# Vivado block design system, xc7z100ffg900-2, Vivado 2022.2
# (continued, part 2 of 3)
current_bd_instance /rx_fir_decimator

# ---- hierarchy /axi_adrv9009_rx_os_jesd ----
current_bd_instance /axi_adrv9009_rx_os_jesd
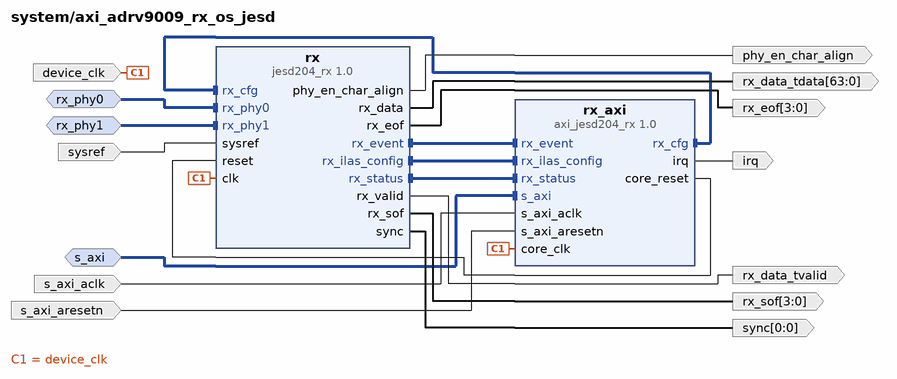
[diagram p13: block diagram inside /axi_adrv9009_rx_os_jesd]
create_bd_intf_pin -mode Slave -vlnv xilinx.com:interface:aximm_rtl:1.0 s_axi
create_bd_intf_pin -mode Slave -vlnv xilinx.com:display_jesd204:jesd204_rx_bus_rtl:1.0 rx_phy0
create_bd_intf_pin -mode Slave -vlnv xilinx.com:display_jesd204:jesd204_rx_bus_rtl:1.0 rx_phy1
create_bd_pin -dir I -type clk s_axi_aclk
create_bd_pin -dir I -type rst s_axi_aresetn
create_bd_pin -dir O -type intr irq
create_bd_pin -dir I -type clk device_clk
create_bd_pin -dir O -from 0 -to 0 sync
create_bd_pin -dir I sysref
create_bd_pin -dir O phy_en_char_align
create_bd_pin -dir O -from 3 -to 0 rx_eof
create_bd_pin -dir O -from 3 -to 0 rx_sof
create_bd_pin -dir O rx_data_tvalid
create_bd_pin -dir O -from 63 -to 0 rx_data_tdata

create_bd_cell -type ip -vlnv analog.com:user:jesd204_rx:1.0 rx
set_property -dict {CONFIG.NUM_LANES 2 CONFIG.NUM_LINKS 1} [get_bd_cells rx]
create_bd_cell -type ip -vlnv analog.com:user:axi_jesd204_rx:1.0 rx_axi
set_property -dict {CONFIG.NUM_LANES 2 CONFIG.NUM_LINKS 1} [get_bd_cells rx_axi]

# ---- hierarchy /rx_os_adrv9009_tpl_core ----
current_bd_instance /rx_os_adrv9009_tpl_core
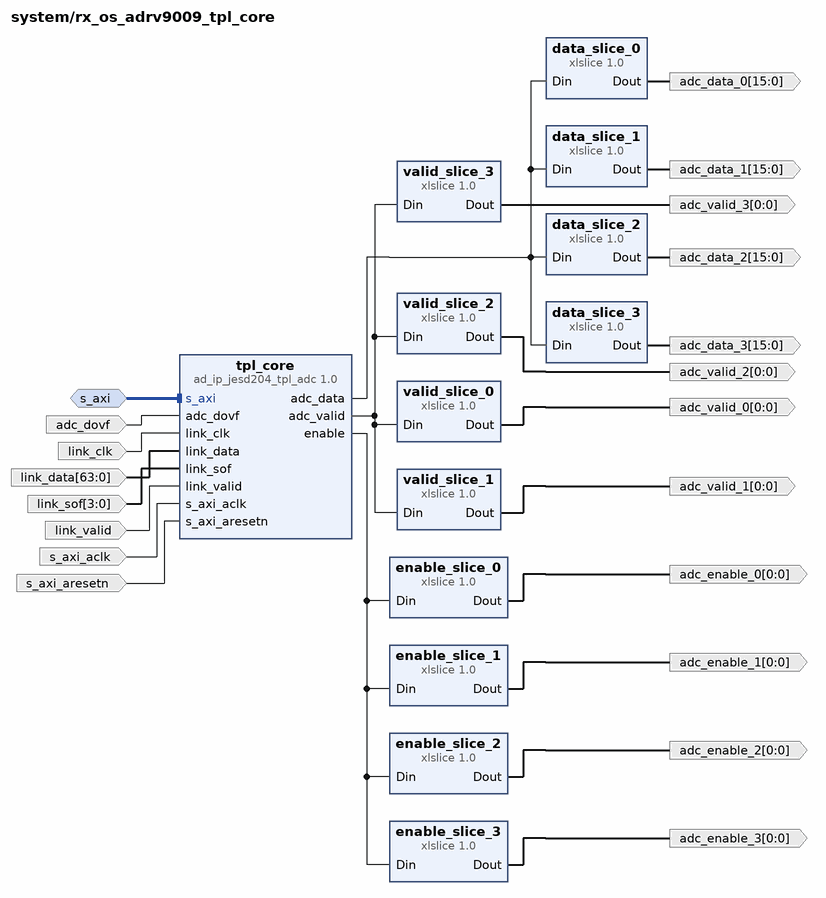
[diagram p14: block diagram inside /rx_os_adrv9009_tpl_core]
create_bd_intf_pin -mode Slave -vlnv xilinx.com:interface:aximm_rtl:1.0 s_axi
create_bd_pin -dir I -type clk s_axi_aclk
create_bd_pin -dir I -type rst s_axi_aresetn
create_bd_pin -dir I -type clk link_clk
create_bd_pin -dir I -from 3 -to 0 link_sof
create_bd_pin -dir I link_valid
create_bd_pin -dir I -from 63 -to 0 link_data
create_bd_pin -dir I adc_dovf
create_bd_pin -dir O -from 0 -to 0 adc_enable_0
create_bd_pin -dir O -from 0 -to 0 adc_valid_0
create_bd_pin -dir O -from 15 -to 0 adc_data_0
create_bd_pin -dir O -from 0 -to 0 adc_enable_1
create_bd_pin -dir O -from 0 -to 0 adc_valid_1
create_bd_pin -dir O -from 15 -to 0 adc_data_1
create_bd_pin -dir O -from 0 -to 0 adc_enable_2
create_bd_pin -dir O -from 0 -to 0 adc_valid_2
create_bd_pin -dir O -from 15 -to 0 adc_data_2
create_bd_pin -dir O -from 0 -to 0 adc_enable_3
create_bd_pin -dir O -from 0 -to 0 adc_valid_3
create_bd_pin -dir O -from 15 -to 0 adc_data_3

create_bd_cell -type ip -vlnv xilinx.com:ip:xlslice:1.0 data_slice_0
set_property -dict {CONFIG.DIN_FROM 15 CONFIG.DIN_TO 0 CONFIG.DIN_WIDTH 64 CONFIG.DOUT_WIDTH 16} [get_bd_cells data_slice_0]
create_bd_cell -type ip -vlnv xilinx.com:ip:xlslice:1.0 data_slice_1
set_property -dict {CONFIG.DIN_FROM 31 CONFIG.DIN_TO 16 CONFIG.DIN_WIDTH 64 CONFIG.DOUT_WIDTH 16} [get_bd_cells data_slice_1]
create_bd_cell -type ip -vlnv xilinx.com:ip:xlslice:1.0 data_slice_2
set_property -dict {CONFIG.DIN_FROM 47 CONFIG.DIN_TO 32 CONFIG.DIN_WIDTH 64} [get_bd_cells data_slice_2]
create_bd_cell -type ip -vlnv xilinx.com:ip:xlslice:1.0 data_slice_3
set_property -dict {CONFIG.DIN_FROM 63 CONFIG.DIN_TO 48 CONFIG.DIN_WIDTH 64} [get_bd_cells data_slice_3]
create_bd_cell -type ip -vlnv xilinx.com:ip:xlslice:1.0 enable_slice_0
set_property -dict {CONFIG.DIN_FROM 0 CONFIG.DIN_TO 0 CONFIG.DIN_WIDTH 4} [get_bd_cells enable_slice_0]
create_bd_cell -type ip -vlnv xilinx.com:ip:xlslice:1.0 enable_slice_1
set_property -dict {CONFIG.DIN_FROM 1 CONFIG.DIN_TO 1 CONFIG.DIN_WIDTH 4} [get_bd_cells enable_slice_1]
create_bd_cell -type ip -vlnv xilinx.com:ip:xlslice:1.0 enable_slice_2
set_property -dict {CONFIG.DIN_FROM 2 CONFIG.DIN_TO 2 CONFIG.DIN_WIDTH 4} [get_bd_cells enable_slice_2]
create_bd_cell -type ip -vlnv xilinx.com:ip:xlslice:1.0 enable_slice_3
set_property -dict {CONFIG.DIN_FROM 3 CONFIG.DIN_TO 3 CONFIG.DIN_WIDTH 4} [get_bd_cells enable_slice_3]
create_bd_cell -type ip -vlnv xilinx.com:ip:xlslice:1.0 valid_slice_0
set_property -dict {CONFIG.DIN_FROM 0 CONFIG.DIN_TO 0 CONFIG.DIN_WIDTH 4} [get_bd_cells valid_slice_0]
create_bd_cell -type ip -vlnv xilinx.com:ip:xlslice:1.0 valid_slice_1
set_property -dict {CONFIG.DIN_FROM 1 CONFIG.DIN_TO 1 CONFIG.DIN_WIDTH 4} [get_bd_cells valid_slice_1]
create_bd_cell -type ip -vlnv xilinx.com:ip:xlslice:1.0 valid_slice_2
set_property -dict {CONFIG.DIN_FROM 2 CONFIG.DIN_TO 2 CONFIG.DIN_WIDTH 4} [get_bd_cells valid_slice_2]
create_bd_cell -type ip -vlnv xilinx.com:ip:xlslice:1.0 valid_slice_3
set_property -dict {CONFIG.DIN_FROM 3 CONFIG.DIN_TO 3 CONFIG.DIN_WIDTH 4} [get_bd_cells valid_slice_3]
create_bd_cell -type ip -vlnv analog.com:user:ad_ip_jesd204_tpl_adc:1.0 tpl_core
set_property -dict [list \
  CONFIG.BITS_PER_SAMPLE 16 \
  CONFIG.CONVERTER_RESOLUTION 16 \
  CONFIG.NUM_CHANNELS 4 \
  CONFIG.NUM_LANES 2 \
  CONFIG.OCTETS_PER_BEAT 4 \
  CONFIG.SAMPLES_PER_FRAME 1 \
] [get_bd_cells tpl_core]

# ---- connections ----

current_bd_instance /axi_adrv9009_tx_jesd
connect_bd_intf_net [get_bd_intf_pins s_axi] [get_bd_intf_pins tx_axi/s_axi]
connect_bd_intf_net [get_bd_intf_pins tx_axi/tx_cfg] [get_bd_intf_pins tx/tx_cfg]
connect_bd_intf_net [get_bd_intf_pins tx_axi/tx_ctrl] [get_bd_intf_pins tx/tx_ctrl]
connect_bd_intf_net [get_bd_intf_pins tx_data] [get_bd_intf_pins tx/tx_data]
connect_bd_intf_net [get_bd_intf_pins tx/tx_event] [get_bd_intf_pins tx_axi/tx_event]
connect_bd_intf_net [get_bd_intf_pins tx/tx_ilas_config] [get_bd_intf_pins tx_axi/tx_ilas_config]
connect_bd_intf_net [get_bd_intf_pins tx_phy0] [get_bd_intf_pins tx/tx_phy0]
connect_bd_intf_net [get_bd_intf_pins tx_phy1] [get_bd_intf_pins tx/tx_phy1]
connect_bd_intf_net [get_bd_intf_pins tx_phy2] [get_bd_intf_pins tx/tx_phy2]
connect_bd_intf_net [get_bd_intf_pins tx_phy3] [get_bd_intf_pins tx/tx_phy3]
connect_bd_intf_net [get_bd_intf_pins tx/tx_status] [get_bd_intf_pins tx_axi/tx_status]
connect_bd_net [get_bd_pins device_clk] [get_bd_pins tx/clk] [get_bd_pins tx_axi/core_clk]
connect_bd_net [get_bd_pins s_axi_aclk] [get_bd_pins tx_axi/s_axi_aclk]
connect_bd_net [get_bd_pins s_axi_aresetn] [get_bd_pins tx_axi/s_axi_aresetn]
connect_bd_net [get_bd_pins sync] [get_bd_pins tx/sync]
connect_bd_net [get_bd_pins sysref] [get_bd_pins tx/sysref]
connect_bd_net [get_bd_pins tx_axi/core_reset] [get_bd_pins tx/reset]
connect_bd_net [get_bd_pins tx_axi/irq] [get_bd_pins irq]

current_bd_instance /tx_fir_interpolator
connect_bd_net [get_bd_pins aclk] \
  [get_bd_pins rate_gen/clk] [get_bd_pins fir_interpolation_0/aclk] [get_bd_pins fir_interpolation_1/aclk] \
  [get_bd_pins fir_interpolation_2/aclk] [get_bd_pins fir_interpolation_3/aclk]
connect_bd_net [get_bd_pins active] \
  [get_bd_pins out_mux_1/select_path] [get_bd_pins out_mux_2/select_path] [get_bd_pins out_mux_3/select_path] \
  [get_bd_pins rate_gen/rstn] [get_bd_pins out_mux_0/select_path]
connect_bd_net -net dac_enable_0_1 [get_bd_pins dac_enable_0] [get_bd_pins out_mux_0/enable_in_0] [get_bd_pins out_mux_0/enable_in_1]
connect_bd_net -net dac_enable_1_1 [get_bd_pins dac_enable_1] [get_bd_pins out_mux_1/enable_in_1] [get_bd_pins out_mux_1/enable_in_0]
connect_bd_net -net dac_enable_2_1 [get_bd_pins dac_enable_2] [get_bd_pins out_mux_2/enable_in_1] [get_bd_pins out_mux_2/enable_in_0]
connect_bd_net -net dac_enable_3_1 [get_bd_pins dac_enable_3] [get_bd_pins out_mux_3/enable_in_1] [get_bd_pins out_mux_3/enable_in_0]
connect_bd_net -net dac_valid_0_1 [get_bd_pins dac_valid_0] [get_bd_pins out_mux_0/valid_in_0] [get_bd_pins logic_and_0/Op2]
connect_bd_net -net dac_valid_1_1 [get_bd_pins dac_valid_1] [get_bd_pins out_mux_1/valid_in_0] [get_bd_pins logic_and_1/Op2]
connect_bd_net -net dac_valid_2_1 [get_bd_pins dac_valid_2] [get_bd_pins out_mux_2/valid_in_0] [get_bd_pins logic_and_2/Op2]
connect_bd_net -net dac_valid_3_1 [get_bd_pins dac_valid_3] [get_bd_pins out_mux_3/valid_in_0] [get_bd_pins logic_and_3/Op2]
connect_bd_net -net data_in_0_1 [get_bd_pins data_in_0] [get_bd_pins out_mux_0/data_in_0] [get_bd_pins fir_interpolation_0/s_axis_data_tdata]
connect_bd_net -net data_in_1_1 [get_bd_pins data_in_1] [get_bd_pins out_mux_1/data_in_0] [get_bd_pins fir_interpolation_1/s_axis_data_tdata]
connect_bd_net -net data_in_2_1 [get_bd_pins data_in_2] [get_bd_pins out_mux_2/data_in_0] [get_bd_pins fir_interpolation_2/s_axis_data_tdata]
connect_bd_net -net data_in_3_1 [get_bd_pins data_in_3] [get_bd_pins out_mux_3/data_in_0] [get_bd_pins fir_interpolation_3/s_axis_data_tdata]
connect_bd_net [get_bd_pins fir_interpolation_0/m_axis_data_tdata] [get_bd_pins out_mux_0/data_in_1]
connect_bd_net [get_bd_pins fir_interpolation_1/m_axis_data_tdata] [get_bd_pins out_mux_1/data_in_1]
connect_bd_net [get_bd_pins fir_interpolation_2/m_axis_data_tdata] [get_bd_pins out_mux_2/data_in_1]
connect_bd_net [get_bd_pins fir_interpolation_3/m_axis_data_tdata] [get_bd_pins out_mux_3/data_in_1]
connect_bd_net [get_bd_pins load_config] [get_bd_pins rate_gen/load_config]
connect_bd_net [get_bd_pins logic_and_0/Res] [get_bd_pins fir_interpolation_0/s_axis_data_tvalid]
connect_bd_net [get_bd_pins logic_and_1/Res] [get_bd_pins fir_interpolation_1/s_axis_data_tvalid]
connect_bd_net [get_bd_pins logic_and_2/Res] [get_bd_pins fir_interpolation_2/s_axis_data_tvalid]
connect_bd_net [get_bd_pins logic_and_3/Res] [get_bd_pins fir_interpolation_3/s_axis_data_tvalid]
connect_bd_net [get_bd_pins out_mux_0/data_out] [get_bd_pins data_out_0]
connect_bd_net [get_bd_pins out_mux_0/enable_out] [get_bd_pins enable_out_0]
connect_bd_net [get_bd_pins out_mux_0/valid_out] [get_bd_pins valid_out_0]
connect_bd_net [get_bd_pins out_mux_1/data_out] [get_bd_pins data_out_1]
connect_bd_net [get_bd_pins out_mux_1/enable_out] [get_bd_pins enable_out_1]
connect_bd_net [get_bd_pins out_mux_1/valid_out] [get_bd_pins valid_out_1]
connect_bd_net [get_bd_pins out_mux_2/data_out] [get_bd_pins data_out_2]
connect_bd_net [get_bd_pins out_mux_2/enable_out] [get_bd_pins enable_out_2]
connect_bd_net [get_bd_pins out_mux_2/valid_out] [get_bd_pins valid_out_2]
connect_bd_net [get_bd_pins out_mux_3/data_out] [get_bd_pins data_out_3]
connect_bd_net [get_bd_pins out_mux_3/enable_out] [get_bd_pins enable_out_3]
connect_bd_net [get_bd_pins out_mux_3/valid_out] [get_bd_pins valid_out_3]
connect_bd_net [get_bd_pins pulse_width] [get_bd_pins rate_gen/pulse_width] [get_bd_pins rate_gen/pulse_period]
connect_bd_net [get_bd_pins rate_gen/pulse] \
  [get_bd_pins out_mux_1/valid_in_1] [get_bd_pins out_mux_2/valid_in_1] [get_bd_pins out_mux_3/valid_in_1] \
  [get_bd_pins out_mux_0/valid_in_1] [get_bd_pins logic_and_0/Op1] [get_bd_pins logic_and_1/Op1] \
  [get_bd_pins logic_and_2/Op1] [get_bd_pins logic_and_3/Op1]

current_bd_instance /tx_adrv9009_tpl_core
connect_bd_intf_net [get_bd_intf_pins s_axi] [get_bd_intf_pins tpl_core/s_axi]
connect_bd_intf_net [get_bd_intf_pins link] [get_bd_intf_pins tpl_core/link]
connect_bd_net -net dac_data_0_1 [get_bd_pins dac_data_0] [get_bd_pins data_concat/In0]
connect_bd_net -net dac_data_1_1 [get_bd_pins dac_data_1] [get_bd_pins data_concat/In1]
connect_bd_net -net dac_data_2_1 [get_bd_pins dac_data_2] [get_bd_pins data_concat/In2]
connect_bd_net -net dac_data_3_1 [get_bd_pins dac_data_3] [get_bd_pins data_concat/In3]
connect_bd_net [get_bd_pins dac_dunf] [get_bd_pins tpl_core/dac_dunf]
connect_bd_net [get_bd_pins data_concat/dout] [get_bd_pins tpl_core/dac_ddata]
connect_bd_net [get_bd_pins enable_slice_0/Dout] [get_bd_pins dac_enable_0]
connect_bd_net [get_bd_pins enable_slice_1/Dout] [get_bd_pins dac_enable_1]
connect_bd_net [get_bd_pins enable_slice_2/Dout] [get_bd_pins dac_enable_2]
connect_bd_net [get_bd_pins enable_slice_3/Dout] [get_bd_pins dac_enable_3]
connect_bd_net [get_bd_pins link_clk] [get_bd_pins tpl_core/link_clk]
connect_bd_net [get_bd_pins s_axi_aclk] [get_bd_pins tpl_core/s_axi_aclk]
connect_bd_net [get_bd_pins s_axi_aresetn] [get_bd_pins tpl_core/s_axi_aresetn]
connect_bd_net [get_bd_pins tpl_core/dac_valid] \
  [get_bd_pins valid_slice_0/Din] [get_bd_pins valid_slice_1/Din] [get_bd_pins valid_slice_2/Din] \
  [get_bd_pins valid_slice_3/Din]
connect_bd_net [get_bd_pins tpl_core/enable] \
  [get_bd_pins enable_slice_0/Din] [get_bd_pins enable_slice_1/Din] [get_bd_pins enable_slice_2/Din] \
  [get_bd_pins enable_slice_3/Din]
connect_bd_net [get_bd_pins valid_slice_0/Dout] [get_bd_pins dac_valid_0]
connect_bd_net [get_bd_pins valid_slice_1/Dout] [get_bd_pins dac_valid_1]
connect_bd_net [get_bd_pins valid_slice_2/Dout] [get_bd_pins dac_valid_2]
connect_bd_net [get_bd_pins valid_slice_3/Dout] [get_bd_pins dac_valid_3]

current_bd_instance /axi_adrv9009_rx_jesd
connect_bd_intf_net [get_bd_intf_pins rx_axi/rx_cfg] [get_bd_intf_pins rx/rx_cfg]
connect_bd_intf_net [get_bd_intf_pins rx_phy0] [get_bd_intf_pins rx/rx_phy0]
connect_bd_intf_net [get_bd_intf_pins rx_phy1] [get_bd_intf_pins rx/rx_phy1]
connect_bd_intf_net [get_bd_intf_pins rx/rx_event] [get_bd_intf_pins rx_axi/rx_event]
connect_bd_intf_net [get_bd_intf_pins rx/rx_ilas_config] [get_bd_intf_pins rx_axi/rx_ilas_config]
connect_bd_intf_net [get_bd_intf_pins rx/rx_status] [get_bd_intf_pins rx_axi/rx_status]
connect_bd_intf_net [get_bd_intf_pins s_axi] [get_bd_intf_pins rx_axi/s_axi]
connect_bd_net [get_bd_pins device_clk] [get_bd_pins rx/clk] [get_bd_pins rx_axi/core_clk]
connect_bd_net [get_bd_pins rx_axi/core_reset] [get_bd_pins rx/reset] [get_bd_pins iq_core_reset]
connect_bd_net [get_bd_pins rx_axi/irq] [get_bd_pins irq]
connect_bd_net [get_bd_pins rx/phy_en_char_align] [get_bd_pins phy_en_char_align]
connect_bd_net [get_bd_pins rx/rx_data] [get_bd_pins rx_data_tdata]
connect_bd_net [get_bd_pins rx/rx_eof] [get_bd_pins rx_eof]
connect_bd_net [get_bd_pins rx/rx_sof] [get_bd_pins rx_sof]
connect_bd_net [get_bd_pins rx/rx_valid] [get_bd_pins rx_data_tvalid]
connect_bd_net [get_bd_pins rx/status_ctrl_state] [get_bd_pins iq_ctrl_state] [get_bd_pins rx_axi/core_status_ctrl_state]
connect_bd_net [get_bd_pins rx/status_lane_cgs_state] [get_bd_pins iq_lane_cgs_state] [get_bd_pins rx_axi/core_status_lane_cgs_state]
connect_bd_net [get_bd_pins rx/sync] [get_bd_pins sync]
connect_bd_net [get_bd_pins s_axi_aclk] [get_bd_pins rx_axi/s_axi_aclk]
connect_bd_net [get_bd_pins s_axi_aresetn] [get_bd_pins rx_axi/s_axi_aresetn]
connect_bd_net [get_bd_pins sysref] [get_bd_pins rx/sysref]

current_bd_instance /rx_adrv9009_tpl_core
connect_bd_intf_net [get_bd_intf_pins s_axi] [get_bd_intf_pins tpl_core/s_axi]
connect_bd_net [get_bd_pins adc_dovf] [get_bd_pins tpl_core/adc_dovf]
connect_bd_net -net data_slice_0_Dout [get_bd_pins data_slice_0/Dout] [get_bd_pins adc_data_0]
connect_bd_net -net data_slice_1_Dout [get_bd_pins data_slice_1/Dout] [get_bd_pins adc_data_1]
connect_bd_net -net data_slice_2_Dout [get_bd_pins data_slice_2/Dout] [get_bd_pins adc_data_2]
connect_bd_net -net data_slice_3_Dout [get_bd_pins data_slice_3/Dout] [get_bd_pins adc_data_3]
connect_bd_net -net enable_slice_0_Dout [get_bd_pins enable_slice_0/Dout] [get_bd_pins adc_enable_0]
connect_bd_net -net enable_slice_1_Dout [get_bd_pins enable_slice_1/Dout] [get_bd_pins adc_enable_1]
connect_bd_net [get_bd_pins enable_slice_2/Dout] [get_bd_pins adc_enable_2]
connect_bd_net [get_bd_pins enable_slice_3/Dout] [get_bd_pins adc_enable_3]
connect_bd_net [get_bd_pins link_clk] [get_bd_pins tpl_core/link_clk]
connect_bd_net [get_bd_pins link_data] [get_bd_pins tpl_core/link_data]
connect_bd_net [get_bd_pins link_sof] [get_bd_pins tpl_core/link_sof]
connect_bd_net [get_bd_pins link_valid] [get_bd_pins tpl_core/link_valid]
connect_bd_net [get_bd_pins s_axi_aclk] [get_bd_pins tpl_core/s_axi_aclk]
connect_bd_net [get_bd_pins s_axi_aresetn] [get_bd_pins tpl_core/s_axi_aresetn]
connect_bd_net [get_bd_pins tpl_core/adc_data] \
  [get_bd_pins data_slice_0/Din] [get_bd_pins data_slice_1/Din] [get_bd_pins data_slice_2/Din] [get_bd_pins data_slice_3/Din]
connect_bd_net [get_bd_pins tpl_core/adc_valid] \
  [get_bd_pins valid_slice_0/Din] [get_bd_pins valid_slice_1/Din] [get_bd_pins valid_slice_2/Din] \
  [get_bd_pins valid_slice_3/Din]
connect_bd_net [get_bd_pins tpl_core/enable] \
  [get_bd_pins enable_slice_0/Din] [get_bd_pins enable_slice_1/Din] [get_bd_pins enable_slice_2/Din] \
  [get_bd_pins enable_slice_3/Din]
connect_bd_net -net valid_slice_0_Dout [get_bd_pins valid_slice_0/Dout] [get_bd_pins adc_valid_0]
connect_bd_net -net valid_slice_1_Dout [get_bd_pins valid_slice_1/Dout] [get_bd_pins adc_valid_1]
connect_bd_net [get_bd_pins valid_slice_2/Dout] [get_bd_pins adc_valid_2]
connect_bd_net [get_bd_pins valid_slice_3/Dout] [get_bd_pins adc_valid_3]
set_property HDL_ATTRIBUTE.DEBUG true [get_bd_nets data_slice_0_Dout]
set_property HDL_ATTRIBUTE.DEBUG true [get_bd_nets data_slice_1_Dout]
set_property HDL_ATTRIBUTE.DEBUG true [get_bd_nets data_slice_2_Dout]
set_property HDL_ATTRIBUTE.DEBUG true [get_bd_nets data_slice_3_Dout]
set_property HDL_ATTRIBUTE.DEBUG true [get_bd_nets enable_slice_0_Dout]
set_property HDL_ATTRIBUTE.DEBUG true [get_bd_nets enable_slice_1_Dout]
set_property HDL_ATTRIBUTE.DEBUG true [get_bd_nets valid_slice_0_Dout]
set_property HDL_ATTRIBUTE.DEBUG true [get_bd_nets valid_slice_1_Dout]

current_bd_instance /rx_fir_decimator
connect_bd_net [get_bd_pins aclk] \
  [get_bd_pins fir_decimation_0/aclk] [get_bd_pins fir_decimation_1/aclk] [get_bd_pins fir_decimation_2/aclk] \
  [get_bd_pins fir_decimation_3/aclk]
connect_bd_net [get_bd_pins active] \
  [get_bd_pins out_mux_0/select_path] [get_bd_pins out_mux_1/select_path] [get_bd_pins out_mux_2/select_path] \
  [get_bd_pins out_mux_3/select_path]
connect_bd_net -net data_in_0_1 [get_bd_pins data_in_0] [get_bd_pins out_mux_0/data_in_0] [get_bd_pins fir_decimation_0/s_axis_data_tdata]
connect_bd_net -net data_in_1_1 [get_bd_pins data_in_1] [get_bd_pins out_mux_1/data_in_0] [get_bd_pins fir_decimation_1/s_axis_data_tdata]
connect_bd_net -net data_in_2_1 [get_bd_pins data_in_2] [get_bd_pins out_mux_2/data_in_0] [get_bd_pins fir_decimation_2/s_axis_data_tdata]
connect_bd_net -net data_in_3_1 [get_bd_pins data_in_3] [get_bd_pins out_mux_3/data_in_0] [get_bd_pins fir_decimation_3/s_axis_data_tdata]
connect_bd_net -net enable_in_0_1 [get_bd_pins enable_in_0] [get_bd_pins out_mux_0/enable_in_0] [get_bd_pins out_mux_0/enable_in_1]
connect_bd_net -net enable_in_1_1 [get_bd_pins enable_in_1] [get_bd_pins out_mux_1/enable_in_0] [get_bd_pins out_mux_1/enable_in_1]
connect_bd_net -net enable_in_2_1 [get_bd_pins enable_in_2] [get_bd_pins out_mux_2/enable_in_0] [get_bd_pins out_mux_2/enable_in_1]
connect_bd_net -net enable_in_3_1 [get_bd_pins enable_in_3] [get_bd_pins out_mux_3/enable_in_0] [get_bd_pins out_mux_3/enable_in_1]
connect_bd_net [get_bd_pins fir_decimation_0/m_axis_data_tdata] [get_bd_pins out_mux_0/data_in_1]
connect_bd_net [get_bd_pins fir_decimation_0/m_axis_data_tvalid] [get_bd_pins out_mux_0/valid_in_1]
connect_bd_net [get_bd_pins fir_decimation_1/m_axis_data_tdata] [get_bd_pins out_mux_1/data_in_1]
connect_bd_net [get_bd_pins fir_decimation_1/m_axis_data_tvalid] [get_bd_pins out_mux_1/valid_in_1]
connect_bd_net [get_bd_pins fir_decimation_2/m_axis_data_tdata] [get_bd_pins out_mux_2/data_in_1]
connect_bd_net [get_bd_pins fir_decimation_2/m_axis_data_tvalid] [get_bd_pins out_mux_2/valid_in_1]
connect_bd_net [get_bd_pins fir_decimation_3/m_axis_data_tdata] [get_bd_pins out_mux_3/data_in_1]
connect_bd_net [get_bd_pins fir_decimation_3/m_axis_data_tvalid] [get_bd_pins out_mux_3/valid_in_1]
connect_bd_net [get_bd_pins out_mux_0/data_out] [get_bd_pins data_out_0]
connect_bd_net [get_bd_pins out_mux_0/enable_out] [get_bd_pins enable_out_0]
connect_bd_net [get_bd_pins out_mux_0/valid_out] [get_bd_pins valid_out_0]
connect_bd_net [get_bd_pins out_mux_1/data_out] [get_bd_pins data_out_1]
connect_bd_net [get_bd_pins out_mux_1/enable_out] [get_bd_pins enable_out_1]
connect_bd_net [get_bd_pins out_mux_1/valid_out] [get_bd_pins valid_out_1]
connect_bd_net [get_bd_pins out_mux_2/data_out] [get_bd_pins data_out_2]
connect_bd_net [get_bd_pins out_mux_2/enable_out] [get_bd_pins enable_out_2]
connect_bd_net [get_bd_pins out_mux_2/valid_out] [get_bd_pins valid_out_2]
connect_bd_net [get_bd_pins out_mux_3/data_out] [get_bd_pins data_out_3]
connect_bd_net [get_bd_pins out_mux_3/enable_out] [get_bd_pins enable_out_3]
connect_bd_net [get_bd_pins out_mux_3/valid_out] [get_bd_pins valid_out_3]
connect_bd_net -net valid_in_0_1 [get_bd_pins valid_in_0] [get_bd_pins out_mux_0/valid_in_0] [get_bd_pins fir_decimation_0/s_axis_data_tvalid]
connect_bd_net -net valid_in_1_1 [get_bd_pins valid_in_1] [get_bd_pins out_mux_1/valid_in_0] [get_bd_pins fir_decimation_1/s_axis_data_tvalid]
connect_bd_net -net valid_in_2_1 [get_bd_pins valid_in_2] [get_bd_pins out_mux_2/valid_in_0] [get_bd_pins fir_decimation_2/s_axis_data_tvalid]
connect_bd_net -net valid_in_3_1 [get_bd_pins valid_in_3] [get_bd_pins out_mux_3/valid_in_0] [get_bd_pins fir_decimation_3/s_axis_data_tvalid]
set_property HDL_ATTRIBUTE.DEBUG true [get_bd_nets data_in_0_1]
set_property HDL_ATTRIBUTE.DEBUG true [get_bd_nets data_in_1_1]
set_property HDL_ATTRIBUTE.DEBUG true [get_bd_nets data_in_2_1]
set_property HDL_ATTRIBUTE.DEBUG true [get_bd_nets data_in_3_1]
set_property HDL_ATTRIBUTE.DEBUG true [get_bd_nets enable_in_0_1]
set_property HDL_ATTRIBUTE.DEBUG true [get_bd_nets enable_in_1_1]
set_property HDL_ATTRIBUTE.DEBUG true [get_bd_nets valid_in_0_1]
set_property HDL_ATTRIBUTE.DEBUG true [get_bd_nets valid_in_1_1]

current_bd_instance /axi_adrv9009_rx_os_jesd
connect_bd_intf_net [get_bd_intf_pins rx_axi/rx_cfg] [get_bd_intf_pins rx/rx_cfg]
connect_bd_intf_net [get_bd_intf_pins rx_phy0] [get_bd_intf_pins rx/rx_phy0]
connect_bd_intf_net [get_bd_intf_pins rx_phy1] [get_bd_intf_pins rx/rx_phy1]
connect_bd_intf_net [get_bd_intf_pins rx/rx_event] [get_bd_intf_pins rx_axi/rx_event]
connect_bd_intf_net [get_bd_intf_pins rx/rx_ilas_config] [get_bd_intf_pins rx_axi/rx_ilas_config]
connect_bd_intf_net [get_bd_intf_pins rx/rx_status] [get_bd_intf_pins rx_axi/rx_status]
connect_bd_intf_net [get_bd_intf_pins s_axi] [get_bd_intf_pins rx_axi/s_axi]
connect_bd_net [get_bd_pins device_clk] [get_bd_pins rx/clk] [get_bd_pins rx_axi/core_clk]
connect_bd_net [get_bd_pins rx_axi/core_reset] [get_bd_pins rx/reset]
connect_bd_net [get_bd_pins rx_axi/irq] [get_bd_pins irq]
connect_bd_net [get_bd_pins rx/phy_en_char_align] [get_bd_pins phy_en_char_align]
connect_bd_net [get_bd_pins rx/rx_data] [get_bd_pins rx_data_tdata]
connect_bd_net [get_bd_pins rx/rx_eof] [get_bd_pins rx_eof]
connect_bd_net [get_bd_pins rx/rx_sof] [get_bd_pins rx_sof]
connect_bd_net [get_bd_pins rx/rx_valid] [get_bd_pins rx_data_tvalid]
connect_bd_net [get_bd_pins rx/sync] [get_bd_pins sync]
connect_bd_net [get_bd_pins s_axi_aclk] [get_bd_pins rx_axi/s_axi_aclk]
connect_bd_net [get_bd_pins s_axi_aresetn] [get_bd_pins rx_axi/s_axi_aresetn]
connect_bd_net [get_bd_pins sysref] [get_bd_pins rx/sysref]

current_bd_instance /rx_os_adrv9009_tpl_core
connect_bd_intf_net [get_bd_intf_pins s_axi] [get_bd_intf_pins tpl_core/s_axi]
connect_bd_net [get_bd_pins adc_dovf] [get_bd_pins tpl_core/adc_dovf]
connect_bd_net [get_bd_pins data_slice_0/Dout] [get_bd_pins adc_data_0]
connect_bd_net [get_bd_pins data_slice_1/Dout] [get_bd_pins adc_data_1]
connect_bd_net [get_bd_pins data_slice_2/Dout] [get_bd_pins adc_data_2]
connect_bd_net [get_bd_pins data_slice_3/Dout] [get_bd_pins adc_data_3]
connect_bd_net [get_bd_pins enable_slice_0/Dout] [get_bd_pins adc_enable_0]
connect_bd_net [get_bd_pins enable_slice_1/Dout] [get_bd_pins adc_enable_1]
connect_bd_net [get_bd_pins enable_slice_2/Dout] [get_bd_pins adc_enable_2]
connect_bd_net [get_bd_pins enable_slice_3/Dout] [get_bd_pins adc_enable_3]
connect_bd_net [get_bd_pins link_clk] [get_bd_pins tpl_core/link_clk]
connect_bd_net [get_bd_pins link_data] [get_bd_pins tpl_core/link_data]
connect_bd_net [get_bd_pins link_sof] [get_bd_pins tpl_core/link_sof]
connect_bd_net [get_bd_pins link_valid] [get_bd_pins tpl_core/link_valid]
connect_bd_net [get_bd_pins s_axi_aclk] [get_bd_pins tpl_core/s_axi_aclk]
connect_bd_net [get_bd_pins s_axi_aresetn] [get_bd_pins tpl_core/s_axi_aresetn]
connect_bd_net [get_bd_pins tpl_core/adc_data] \
  [get_bd_pins data_slice_0/Din] [get_bd_pins data_slice_1/Din] [get_bd_pins data_slice_2/Din] [get_bd_pins data_slice_3/Din]
connect_bd_net [get_bd_pins tpl_core/adc_valid] \
  [get_bd_pins valid_slice_0/Din] [get_bd_pins valid_slice_1/Din] [get_bd_pins valid_slice_2/Din] \
  [get_bd_pins valid_slice_3/Din]
connect_bd_net [get_bd_pins tpl_core/enable] \
  [get_bd_pins enable_slice_0/Din] [get_bd_pins enable_slice_1/Din] [get_bd_pins enable_slice_2/Din] \
  [get_bd_pins enable_slice_3/Din]
connect_bd_net [get_bd_pins valid_slice_0/Dout] [get_bd_pins adc_valid_0]
connect_bd_net [get_bd_pins valid_slice_1/Dout] [get_bd_pins adc_valid_1]
connect_bd_net [get_bd_pins valid_slice_2/Dout] [get_bd_pins adc_valid_2]
connect_bd_net [get_bd_pins valid_slice_3/Dout] [get_bd_pins adc_valid_3]

current_bd_instance /
connect_bd_intf_net [get_bd_intf_ports TX_CONFIG_BRAM] [get_bd_intf_pins tx_cfg_bram/BRAM_PORTB]
connect_bd_intf_net [get_bd_intf_ports FDMA_S] [get_bd_intf_pins uiFDMA_0/FDMA_S]
connect_bd_intf_net [get_bd_intf_pins axi_cpu_interconnect/S00_AXI] [get_bd_intf_pins sys_ps7/M_AXI_GP0]
connect_bd_intf_net [get_bd_intf_pins axi_hp2_interconnect/S00_AXI] [get_bd_intf_pins axi_adrv9009_rx_dma/m_dest_axi]
connect_bd_intf_net [get_bd_intf_pins axi_hp0_interconnect/S02_AXI] [get_bd_intf_pins axi_adrv9009_rx_os_xcvr/m_axi]
connect_bd_intf_net [get_bd_intf_pins axi_adrv9009_rx_os_xcvr/up_ch_0] [get_bd_intf_pins util_adrv9009_xcvr/up_rx_2]
connect_bd_intf_net [get_bd_intf_pins axi_adrv9009_rx_os_xcvr/up_ch_1] [get_bd_intf_pins util_adrv9009_xcvr/up_rx_3]
connect_bd_intf_net [get_bd_intf_pins axi_adrv9009_rx_os_xcvr/up_es_0] [get_bd_intf_pins util_adrv9009_xcvr/up_es_2]
connect_bd_intf_net [get_bd_intf_pins axi_adrv9009_rx_os_xcvr/up_es_1] [get_bd_intf_pins util_adrv9009_xcvr/up_es_3]
connect_bd_intf_net [get_bd_intf_pins axi_hp0_interconnect/S01_AXI] [get_bd_intf_pins axi_adrv9009_rx_xcvr/m_axi]
connect_bd_intf_net [get_bd_intf_pins axi_adrv9009_rx_xcvr/up_ch_0] [get_bd_intf_pins util_adrv9009_xcvr/up_rx_0]
connect_bd_intf_net [get_bd_intf_pins axi_adrv9009_rx_xcvr/up_ch_1] [get_bd_intf_pins util_adrv9009_xcvr/up_rx_1]
connect_bd_intf_net [get_bd_intf_pins axi_adrv9009_rx_xcvr/up_es_0] [get_bd_intf_pins util_adrv9009_xcvr/up_es_0]
connect_bd_intf_net [get_bd_intf_pins axi_adrv9009_rx_xcvr/up_es_1] [get_bd_intf_pins util_adrv9009_xcvr/up_es_1]
connect_bd_intf_net [get_bd_intf_pins axi_hp3_interconnect/S00_AXI] [get_bd_intf_pins axi_adrv9009_tx_dma/m_src_axi]
connect_bd_intf_net [get_bd_intf_pins util_adrv9009_xcvr/tx_0] [get_bd_intf_pins axi_adrv9009_tx_jesd/tx_phy0]
connect_bd_intf_net [get_bd_intf_pins util_adrv9009_xcvr/tx_3] [get_bd_intf_pins axi_adrv9009_tx_jesd/tx_phy1]
connect_bd_intf_net [get_bd_intf_pins util_adrv9009_xcvr/tx_2] [get_bd_intf_pins axi_adrv9009_tx_jesd/tx_phy2]
connect_bd_intf_net [get_bd_intf_pins util_adrv9009_xcvr/tx_1] [get_bd_intf_pins axi_adrv9009_tx_jesd/tx_phy3]
connect_bd_intf_net [get_bd_intf_pins axi_adrv9009_tx_xcvr/up_ch_0] [get_bd_intf_pins util_adrv9009_xcvr/up_tx_0]
connect_bd_intf_net [get_bd_intf_pins axi_adrv9009_tx_xcvr/up_ch_1] [get_bd_intf_pins util_adrv9009_xcvr/up_tx_1]
connect_bd_intf_net [get_bd_intf_pins axi_adrv9009_tx_xcvr/up_ch_2] [get_bd_intf_pins util_adrv9009_xcvr/up_tx_2]
connect_bd_intf_net [get_bd_intf_pins axi_adrv9009_tx_xcvr/up_ch_3] [get_bd_intf_pins util_adrv9009_xcvr/up_tx_3]
connect_bd_intf_net [get_bd_intf_pins axi_adrv9009_tx_xcvr/up_cm_0] [get_bd_intf_pins util_adrv9009_xcvr/up_cm_0]
connect_bd_intf_net [get_bd_intf_pins axi_bram_ctrl_0/BRAM_PORTA] [get_bd_intf_pins blk_mem_gen_0/BRAM_PORTA]
connect_bd_intf_net [get_bd_intf_pins axi_cpu_interconnect/M00_AXI] [get_bd_intf_pins axi_iic_main/S_AXI]
connect_bd_intf_net [get_bd_intf_pins axi_cpu_interconnect/M01_AXI] [get_bd_intf_pins axi_sysid_0/s_axi]
connect_bd_intf_net [get_bd_intf_pins axi_cpu_interconnect/M05_AXI] [get_bd_intf_pins axi_spdif_tx_core/s_axi]
connect_bd_intf_net [get_bd_intf_pins axi_cpu_interconnect/M06_AXI] [get_bd_intf_pins rx_adrv9009_tpl_core/s_axi]
connect_bd_intf_net [get_bd_intf_pins axi_cpu_interconnect/M07_AXI] [get_bd_intf_pins tx_adrv9009_tpl_core/s_axi]
connect_bd_intf_net [get_bd_intf_pins axi_cpu_interconnect/M08_AXI] [get_bd_intf_pins rx_os_adrv9009_tpl_core/s_axi]
connect_bd_intf_net [get_bd_intf_pins axi_cpu_interconnect/M09_AXI] [get_bd_intf_pins axi_adrv9009_tx_xcvr/s_axi]
connect_bd_intf_net [get_bd_intf_pins axi_cpu_interconnect/M10_AXI] [get_bd_intf_pins axi_adrv9009_tx_clkgen/s_axi]
connect_bd_intf_net [get_bd_intf_pins axi_cpu_interconnect/M11_AXI] [get_bd_intf_pins axi_adrv9009_tx_jesd/s_axi]
connect_bd_intf_net [get_bd_intf_pins axi_cpu_interconnect/M12_AXI] [get_bd_intf_pins axi_adrv9009_tx_dma/s_axi]
connect_bd_intf_net [get_bd_intf_pins axi_cpu_interconnect/M13_AXI] [get_bd_intf_pins axi_adrv9009_rx_xcvr/s_axi]
connect_bd_intf_net [get_bd_intf_pins axi_cpu_interconnect/M14_AXI] [get_bd_intf_pins axi_adrv9009_rx_clkgen/s_axi]
connect_bd_intf_net [get_bd_intf_pins axi_cpu_interconnect/M15_AXI] [get_bd_intf_pins axi_adrv9009_rx_jesd/s_axi]
connect_bd_intf_net [get_bd_intf_pins axi_cpu_interconnect/M16_AXI] [get_bd_intf_pins axi_adrv9009_rx_dma/s_axi]
connect_bd_intf_net [get_bd_intf_pins axi_cpu_interconnect/M17_AXI] [get_bd_intf_pins axi_adrv9009_rx_os_xcvr/s_axi]
connect_bd_intf_net [get_bd_intf_pins axi_cpu_interconnect/M18_AXI] [get_bd_intf_pins axi_adrv9009_rx_os_clkgen/s_axi]
connect_bd_intf_net [get_bd_intf_pins axi_cpu_interconnect/M19_AXI] [get_bd_intf_pins axi_adrv9009_rx_os_jesd/s_axi]
connect_bd_intf_net [get_bd_intf_pins axi_cpu_interconnect/M21_AXI] [get_bd_intf_pins tx_control_gpio/S_AXI]
connect_bd_intf_net [get_bd_intf_pins axi_cpu_interconnect/M22_AXI] [get_bd_intf_pins tx_gt_status_gpio/S_AXI]
connect_bd_intf_net [get_bd_intf_pins axi_cpu_interconnect/M23_AXI] [get_bd_intf_pins tx_cfg_bram_ctrl/S_AXI]
connect_bd_intf_net [get_bd_intf_pins axi_hp0_interconnect/M00_AXI] [get_bd_intf_pins sys_ps7/S_AXI_HP0]
connect_bd_intf_net [get_bd_intf_pins axi_hp2_interconnect/M00_AXI] [get_bd_intf_pins sys_ps7/S_AXI_HP2]
connect_bd_intf_net [get_bd_intf_pins axi_hp3_interconnect/M00_AXI] [get_bd_intf_pins sys_ps7/S_AXI_HP3]
connect_bd_intf_net [get_bd_intf_ports iic_main] [get_bd_intf_pins axi_iic_main/IIC]
connect_bd_intf_net [get_bd_intf_pins axi_interconnect_0/M00_AXI] [get_bd_intf_pins sys_ps7/S_AXI_HP1]
connect_bd_intf_net [get_bd_intf_pins sys_ps7/DMA0_REQ] [get_bd_intf_pins axi_spdif_tx_core/dma_req]
connect_bd_intf_net [get_bd_intf_pins smartconnect_0/M00_AXI] [get_bd_intf_pins axi_bram_ctrl_0/S_AXI]
connect_bd_intf_net [get_bd_intf_pins smartconnect_0/M01_AXI] [get_bd_intf_pins axi_gpio_0/S_AXI]
connect_bd_intf_net [get_bd_intf_ports ddr] [get_bd_intf_pins sys_ps7/DDR]
connect_bd_intf_net [get_bd_intf_pins sys_ps7/DMA0_ACK] [get_bd_intf_pins axi_spdif_tx_core/dma_ack]
connect_bd_intf_net [get_bd_intf_ports fixed_io] [get_bd_intf_pins sys_ps7/FIXED_IO]
connect_bd_intf_net [get_bd_intf_pins sys_ps7/M_AXI_GP1] [get_bd_intf_pins smartconnect_0/S00_AXI]
connect_bd_intf_net [get_bd_intf_pins tx_cfg_bram_ctrl/BRAM_PORTA] [get_bd_intf_pins tx_cfg_bram/BRAM_PORTA]
connect_bd_intf_net [get_bd_intf_pins axi_adrv9009_tx_jesd/tx_data] [get_bd_intf_pins tx_adrv9009_tpl_core/link]
connect_bd_intf_net [get_bd_intf_pins uiFDMA_0/M_AXI] [get_bd_intf_pins axi_interconnect_0/S00_AXI]
connect_bd_intf_net [get_bd_intf_pins util_adrv9009_rx_cpack/packed_fifo_wr] [get_bd_intf_pins axi_adrv9009_rx_dma/fifo_wr]
connect_bd_intf_net [get_bd_intf_pins util_adrv9009_xcvr/rx_0] [get_bd_intf_pins axi_adrv9009_rx_jesd/rx_phy0]
connect_bd_intf_net [get_bd_intf_pins util_adrv9009_xcvr/rx_1] [get_bd_intf_pins axi_adrv9009_rx_jesd/rx_phy1]
connect_bd_intf_net [get_bd_intf_pins util_adrv9009_xcvr/rx_2] [get_bd_intf_pins axi_adrv9009_rx_os_jesd/rx_phy0]
connect_bd_intf_net [get_bd_intf_pins util_adrv9009_xcvr/rx_3] [get_bd_intf_pins axi_adrv9009_rx_os_jesd/rx_phy1]
connect_bd_net [get_bd_pins GND_1/dout] \
  [get_bd_pins tx_fir_interpolator/load_config] [get_bd_pins sys_concat_intc/In0] [get_bd_pins sys_concat_intc/In1] \
  [get_bd_pins sys_concat_intc/In2] [get_bd_pins sys_concat_intc/In3] [get_bd_pins sys_concat_intc/In4] \
  [get_bd_pins sys_concat_intc/In5] [get_bd_pins sys_concat_intc/In6] [get_bd_pins sys_concat_intc/In7] \
  [get_bd_pins wave_spi_new_0/spi_cs] [get_bd_pins dacfifo_axi_rstgen/mb_debug_sys_rst] \
  [get_bd_pins tx_ctrl_reset/aux_reset_in] [get_bd_pins tx_ctrl_reset/mb_debug_sys_rst]
connect_bd_net [get_bd_pins GND_32/dout] [get_bd_pins tx_fir_interpolator/pulse_width] [get_bd_pins wave_spi_new_0/spi_mosi]
connect_bd_net [get_bd_pins proc_sys_reset_1/peripheral_aresetn] \
  [get_bd_pins bram_add_fir_newname_0/rst_n] [get_bd_pins fft_add_mult_ip_new_0/aresetn] \
  [get_bd_pins fft_add_mult_ip_new_0/ddr_init_complete] [get_bd_pins find_bfs_top_1/rst_n]
connect_bd_net [get_bd_pins VCC_1/dout] \
  [get_bd_pins util_adrv9009_tx_upack/s_axis_valid] [get_bd_pins dacfifo_axi_rstgen/dcm_locked] \
  [get_bd_pins dacfifo_axi_rstgen/aux_reset_in]
connect_bd_net -net WaveOut_Spi_Top_0_Np [get_bd_pins wave_spi_new_0/Np] [get_bd_ports sampling_num]
connect_bd_net -net active_1 [get_bd_ports dac_fir_filter_active] [get_bd_pins tx_fir_interpolator/active]
connect_bd_net -net active_2 [get_bd_ports adc_fir_filter_active] [get_bd_pins rx_fir_decimator/active]
connect_bd_net -net adc_dovf_1 [get_bd_pins util_adrv9009_rx_cpack/fifo_wr_overflow] [get_bd_pins rx_adrv9009_tpl_core/adc_dovf]
connect_bd_net -net adc_dovf_2 [get_bd_pins util_adrv9009_rx_os_cpack/fifo_wr_overflow] [get_bd_pins rx_os_adrv9009_tpl_core/adc_dovf]
connect_bd_net -net adrv9009_rx_device_clk [get_bd_pins axi_adrv9009_rx_clkgen/clk_0] \
  [get_bd_pins axi_adrv9009_rx_jesd/device_clk] [get_bd_pins rx_adrv9009_tpl_core/link_clk] \
  [get_bd_pins rx_fir_decimator/aclk] [get_bd_pins adrv9009_rx_device_clk_rstgen/slowest_sync_clk] \
  [get_bd_pins util_adrv9009_rx_cpack/clk] [get_bd_pins util_adrv9009_xcvr/rx_clk_0] \
  [get_bd_pins util_adrv9009_xcvr/rx_clk_1] [get_bd_pins axi_adrv9009_rx_dma/fifo_wr_clk] [get_bd_ports clk_160] \
  [get_bd_pins uiFDMA_0/M_AXI_ACLK] [get_bd_pins sys_ps7/S_AXI_HP1_ACLK] [get_bd_ports clk_fs_half] \
  [get_bd_pins proc_sys_reset_1/slowest_sync_clk] [get_bd_pins state_change_0/clk] [get_bd_pins bram_rd_wr_1/clk] \
  [get_bd_pins axi_interconnect_0/ACLK] [get_bd_pins axi_interconnect_0/S00_ACLK] [get_bd_pins axi_interconnect_0/M00_ACLK] \
  [get_bd_pins blk_mem_gen_0/clkb] [get_bd_pins bram_add_fir_newname_0/clk] [get_bd_pins clk_wiz_0/clk_in1] \
  [get_bd_pins fft_add_mult_ip_new_0/aclk] [get_bd_pins find_bfs_top_1/clk] [get_bd_pins wave_spi_new_0/clk_100_in] \
  [get_bd_pins wave_spi_new_0/spi_sck] [get_bd_pins generic_iq_observer_0/rx_clk] [get_bd_pins ila_generic_iq/clk]
connect_bd_net [get_bd_pins adrv9009_rx_device_clk_rstgen/peripheral_aresetn] \
  [get_bd_pins uiFDMA_0/M_AXI_ARESETN] [get_bd_pins state_change_0/rst_n] [get_bd_pins bram_rd_wr_1/rst_n] \
  [get_bd_pins wave_spi_new_0/rst_n]
connect_bd_net [get_bd_pins adrv9009_rx_device_clk_rstgen/peripheral_reset] \
  [get_bd_pins util_adrv9009_rx_cpack/reset] [get_bd_pins generic_iq_observer_0/rx_reset] \
  [get_bd_pins ila_generic_iq/probe12]
connect_bd_net -net adrv9009_rx_os_device_clk [get_bd_pins axi_adrv9009_rx_os_clkgen/clk_0] \
  [get_bd_pins axi_adrv9009_rx_os_jesd/device_clk] [get_bd_pins rx_os_adrv9009_tpl_core/link_clk] \
  [get_bd_pins adrv9009_rx_os_device_clk_rstgen/slowest_sync_clk] [get_bd_pins util_adrv9009_rx_os_cpack/clk] \
  [get_bd_pins util_adrv9009_xcvr/rx_clk_2] [get_bd_pins util_adrv9009_xcvr/rx_clk_3]
connect_bd_net [get_bd_pins adrv9009_rx_os_device_clk_rstgen/peripheral_reset] [get_bd_pins util_adrv9009_rx_os_cpack/reset]
connect_bd_net -net adrv9009_tx_device_clk [get_bd_pins axi_adrv9009_tx_clkgen/clk_0] \
  [get_bd_pins axi_adrv9009_tx_jesd/device_clk] [get_bd_pins tx_adrv9009_tpl_core/link_clk] \
  [get_bd_pins tx_fir_interpolator/aclk] [get_bd_pins adrv9009_tx_device_clk_rstgen/slowest_sync_clk] \
  [get_bd_pins util_adrv9009_tx_upack/clk] [get_bd_pins util_adrv9009_xcvr/tx_clk_0] \
  [get_bd_pins util_adrv9009_xcvr/tx_clk_1] [get_bd_pins util_adrv9009_xcvr/tx_clk_2] \
  [get_bd_pins util_adrv9009_xcvr/tx_clk_3] [get_bd_pins axi_adrv9009_dacfifo/dac_clk] [get_bd_pins pulse_gen_0/clk] \
  [get_bd_pins system_ila_0/clk]
connect_bd_net [get_bd_pins adrv9009_tx_device_clk_rstgen/peripheral_aresetn] [get_bd_pins pulse_gen_0/rst]
connect_bd_net [get_bd_pins adrv9009_tx_device_clk_rstgen/peripheral_reset] \
  [get_bd_pins util_adrv9009_tx_upack/reset] [get_bd_pins axi_adrv9009_dacfifo/dac_rst]
connect_bd_net [get_bd_pins axi_adrv9009_dacfifo/dac_data] [get_bd_pins util_adrv9009_tx_upack/s_axis_data]
connect_bd_net [get_bd_pins axi_adrv9009_dacfifo/dma_ready] [get_bd_pins axi_adrv9009_tx_dma/m_axis_ready]
connect_bd_net [get_bd_pins axi_adrv9009_rx_dma/irq] [get_bd_pins sys_concat_intc/In13]
connect_bd_net [get_bd_pins axi_adrv9009_rx_jesd/iq_core_reset] \
  [get_bd_pins generic_iq_observer_0/jesd_core_reset] [get_bd_pins ila_generic_iq/probe11]
connect_bd_net [get_bd_pins axi_adrv9009_rx_jesd/iq_ctrl_state] \
  [get_bd_pins generic_iq_observer_0/jesd_ctrl_state] [get_bd_pins ila_generic_iq/probe9]
connect_bd_net [get_bd_pins axi_adrv9009_rx_jesd/iq_lane_cgs_state] \
  [get_bd_pins generic_iq_observer_0/jesd_lane_cgs_state] [get_bd_pins ila_generic_iq/probe10]
connect_bd_net [get_bd_pins axi_adrv9009_rx_jesd/irq] [get_bd_pins sys_concat_intc/In10]
connect_bd_net [get_bd_pins axi_adrv9009_rx_jesd/phy_en_char_align] \
  [get_bd_pins util_adrv9009_xcvr/rx_calign_0] [get_bd_pins util_adrv9009_xcvr/rx_calign_1]
connect_bd_net [get_bd_pins axi_adrv9009_rx_jesd/rx_data_tdata] [get_bd_pins rx_adrv9009_tpl_core/link_data]
connect_bd_net [get_bd_pins axi_adrv9009_rx_jesd/rx_data_tvalid] \
  [get_bd_pins rx_adrv9009_tpl_core/link_valid] [get_bd_pins generic_iq_observer_0/jesd_data_valid] \
  [get_bd_pins ila_generic_iq/probe7]
connect_bd_net [get_bd_pins axi_adrv9009_rx_jesd/rx_sof] \
  [get_bd_pins rx_adrv9009_tpl_core/link_sof] [get_bd_pins generic_iq_observer_0/jesd_sof] \
  [get_bd_pins ila_generic_iq/probe8]
connect_bd_net [get_bd_pins axi_adrv9009_rx_jesd/sync] [get_bd_ports rx_sync_0]
connect_bd_net [get_bd_pins axi_adrv9009_rx_os_jesd/irq] [get_bd_pins sys_concat_intc/In8]
connect_bd_net [get_bd_pins axi_adrv9009_rx_os_jesd/phy_en_char_align] \
  [get_bd_pins util_adrv9009_xcvr/rx_calign_2] [get_bd_pins util_adrv9009_xcvr/rx_calign_3]
connect_bd_net [get_bd_pins axi_adrv9009_rx_os_jesd/rx_data_tdata] [get_bd_pins rx_os_adrv9009_tpl_core/link_data]
connect_bd_net [get_bd_pins axi_adrv9009_rx_os_jesd/rx_data_tvalid] [get_bd_pins rx_os_adrv9009_tpl_core/link_valid]
connect_bd_net [get_bd_pins axi_adrv9009_rx_os_jesd/rx_sof] [get_bd_pins rx_os_adrv9009_tpl_core/link_sof]
connect_bd_net [get_bd_pins axi_adrv9009_rx_os_jesd/sync] [get_bd_ports rx_sync_2]
connect_bd_net [get_bd_pins axi_adrv9009_rx_os_xcvr/up_pll_rst] \
  [get_bd_pins util_adrv9009_xcvr/up_cpll_rst_2] [get_bd_pins util_adrv9009_xcvr/up_cpll_rst_3]
connect_bd_net [get_bd_pins axi_adrv9009_rx_xcvr/up_pll_rst] \
  [get_bd_pins util_adrv9009_xcvr/up_cpll_rst_0] [get_bd_pins util_adrv9009_xcvr/up_cpll_rst_1]
connect_bd_net [get_bd_pins axi_adrv9009_tx_dma/irq] [get_bd_pins sys_concat_intc/In12]
connect_bd_net [get_bd_pins axi_adrv9009_tx_dma/m_axis_data] [get_bd_pins axi_adrv9009_dacfifo/dma_data]
connect_bd_net [get_bd_pins axi_adrv9009_tx_dma/m_axis_last] [get_bd_pins axi_adrv9009_dacfifo/dma_xfer_last]
connect_bd_net [get_bd_pins axi_adrv9009_tx_dma/m_axis_valid] [get_bd_pins axi_adrv9009_dacfifo/dma_valid]
connect_bd_net [get_bd_pins axi_adrv9009_tx_dma/m_axis_xfer_req] [get_bd_pins axi_adrv9009_dacfifo/dma_xfer_req]
connect_bd_net [get_bd_pins axi_adrv9009_tx_jesd/irq] [get_bd_pins sys_concat_intc/In9]
connect_bd_net [get_bd_pins axi_adrv9009_tx_xcvr/up_pll_rst] [get_bd_pins util_adrv9009_xcvr/up_qpll_rst_0]
connect_bd_net [get_bd_pins axi_gpio_0/gpio_io_o] [get_bd_ports gpio_out]
connect_bd_net [get_bd_pins axi_iic_main/iic2intc_irpt] [get_bd_pins sys_concat_intc/In14]
connect_bd_net [get_bd_pins axi_spdif_tx_core/spdif_tx_o] [get_bd_ports spdif]
connect_bd_net [get_bd_pins axi_sysid_0/rom_addr] [get_bd_pins rom_sys_0/rom_addr]
connect_bd_net [get_bd_pins blk_mem_gen_0/doutb] [get_bd_pins state_change_0/dout_in]
connect_bd_net [get_bd_pins bram_add_fir_newname_0/dout] [get_bd_pins find_bfs_top_1/data]
connect_bd_net [get_bd_pins bram_add_fir_newname_0/output_en_0] [get_bd_ports output_en]
connect_bd_net [get_bd_pins bram_add_fir_newname_0/output_valid] [get_bd_pins find_bfs_top_1/dout_valid]
connect_bd_net [get_bd_pins bram_rd_wr_1/din_out] [get_bd_pins blk_mem_gen_0/dinb]
connect_bd_net [get_bd_pins bram_rd_wr_1/ram_addr] [get_bd_pins blk_mem_gen_0/addrb]
connect_bd_net [get_bd_pins bram_rd_wr_1/ram_en] [get_bd_pins blk_mem_gen_0/enb]
connect_bd_net [get_bd_pins bram_rd_wr_1/ram_rst] [get_bd_pins blk_mem_gen_0/rstb]
connect_bd_net [get_bd_pins bram_rd_wr_1/ram_we] [get_bd_pins blk_mem_gen_0/web]
connect_bd_net -net bypass_0_1 [get_bd_ports dac_fifo_bypass] [get_bd_pins axi_adrv9009_dacfifo/bypass]
connect_bd_net [get_bd_pins clk_wiz_0/locked] [get_bd_ports locked]
connect_bd_net -net dac_dunf_1 [get_bd_pins axi_adrv9009_dacfifo/dac_dunf] [get_bd_pins tx_adrv9009_tpl_core/dac_dunf]
connect_bd_net [get_bd_pins dacfifo_axi_rstgen/peripheral_aresetn] [get_bd_pins axi_adrv9009_dacfifo/axi_resetn]
connect_bd_net -net data_trans_en_0_1 [get_bd_ports data_trans_en] [get_bd_pins bram_add_fir_newname_0/data_trans_en]
connect_bd_net [get_bd_ports din_add] [get_bd_pins bram_add_fir_newname_0/din]
connect_bd_net [get_bd_ports end_add] [get_bd_pins state_change_0/end_add]
connect_bd_net [get_bd_ports end_fdma] [get_bd_pins state_change_0/end_fdma]
connect_bd_net [get_bd_ports end_rst] [get_bd_pins state_change_0/end_rst]
connect_bd_net -net ext_reset_in_0_1 [get_bd_ports rst_in] [get_bd_pins proc_sys_reset_1/ext_reset_in]
connect_bd_net [get_bd_pins fft_add_mult_ip_new_0/data_out] [get_bd_ports dout_fft]
connect_bd_net [get_bd_pins fft_add_mult_ip_new_0/data_out_valid] [get_bd_ports data_out_valid]
connect_bd_net [get_bd_pins fft_add_mult_ip_new_0/fft_valid0] [get_bd_ports fft_valid0]
connect_bd_net [get_bd_pins fft_add_mult_ip_new_0/fft_valid1] [get_bd_ports fft_valid1]
connect_bd_net [get_bd_pins find_bfs_top_1/bfs] [get_bd_ports bfs]
connect_bd_net [get_bd_pins find_bfs_top_1/bfs_valid] [get_bd_ports bfs_valid]
connect_bd_net -net fnum_0_1 [get_bd_ports fnum] [get_bd_pins fft_add_mult_ip_new_0/fnum]
connect_bd_net [get_bd_pins generic_iq_observer_0/link_ready] [get_bd_pins ila_generic_iq/probe6]
connect_bd_net [get_bd_pins generic_iq_observer_0/rx1_i] [get_bd_pins ila_generic_iq/probe0]
connect_bd_net [get_bd_pins generic_iq_observer_0/rx1_q] [get_bd_pins ila_generic_iq/probe1]
connect_bd_net [get_bd_pins generic_iq_observer_0/rx2_i] [get_bd_pins ila_generic_iq/probe2]
connect_bd_net [get_bd_pins generic_iq_observer_0/rx2_q] [get_bd_pins ila_generic_iq/probe3]
connect_bd_net [get_bd_pins generic_iq_observer_0/sample_index] [get_bd_pins ila_generic_iq/probe4]
connect_bd_net [get_bd_pins generic_iq_observer_0/sample_valid] [get_bd_pins ila_generic_iq/probe5]
connect_bd_net [get_bd_ports gpio_i] [get_bd_pins sys_ps7/GPIO_I]
connect_bd_net [get_bd_pins iq_enable_concat/dout] [get_bd_pins generic_iq_observer_0/adc_enable] [get_bd_pins ila_generic_iq/probe13]
connect_bd_net [get_bd_pins logic_or/Res] [get_bd_pins util_adrv9009_tx_upack/fifo_rd_en]
connect_bd_net -net proc_sys_reset_1_interconnect_aresetn [get_bd_pins adrv9009_rx_device_clk_rstgen/interconnect_aresetn] \
  [get_bd_pins axi_interconnect_0/ARESETN] [get_bd_pins axi_interconnect_0/S00_ARESETN] \
  [get_bd_pins axi_interconnect_0/M00_ARESETN]
connect_bd_net [get_bd_pins pulse_gen_0/tx1_i] [get_bd_pins tx_fir_interpolator/data_in_0] [get_bd_pins system_ila_0/probe1]
connect_bd_net [get_bd_pins pulse_gen_0/tx1_i_valid] [get_bd_pins tx_fir_interpolator/dac_valid_0] [get_bd_pins system_ila_0/probe0]
connect_bd_net [get_bd_pins pulse_gen_0/tx1_q] [get_bd_pins tx_fir_interpolator/data_in_1] [get_bd_pins system_ila_0/probe3]
connect_bd_net [get_bd_pins pulse_gen_0/tx1_q_valid] [get_bd_pins tx_fir_interpolator/dac_valid_1] [get_bd_pins system_ila_0/probe2]
connect_bd_net [get_bd_pins pulse_gen_0/tx2_i] [get_bd_pins tx_fir_interpolator/data_in_2] [get_bd_pins system_ila_0/probe5]
connect_bd_net [get_bd_pins pulse_gen_0/tx2_i_valid] [get_bd_pins tx_fir_interpolator/dac_valid_2] [get_bd_pins system_ila_0/probe4]
connect_bd_net [get_bd_pins pulse_gen_0/tx2_q] [get_bd_pins tx_fir_interpolator/data_in_3] [get_bd_pins system_ila_0/probe7]
connect_bd_net [get_bd_pins pulse_gen_0/tx2_q_valid] [get_bd_pins tx_fir_interpolator/dac_valid_3] [get_bd_pins system_ila_0/probe6]
connect_bd_net [get_bd_pins rom_sys_0/rom_data] [get_bd_pins axi_sysid_0/sys_rom_data]
connect_bd_net -net rst_in_1 [get_bd_ports rst_clkwiz] [get_bd_pins clk_wiz_0/resetn]
connect_bd_net -net rx_adrv9009_tpl_core_adc_data_0 [get_bd_pins rx_adrv9009_tpl_core/adc_data_0] \
  [get_bd_ports adc_data_0] [get_bd_pins rx_fir_decimator/data_in_0] [get_bd_pins system_ila_0/probe8] \
  [get_bd_pins generic_iq_observer_0/adc_data_0]
connect_bd_net -net rx_adrv9009_tpl_core_adc_data_1 [get_bd_pins rx_adrv9009_tpl_core/adc_data_1] \
  [get_bd_ports adc_data_1] [get_bd_pins rx_fir_decimator/data_in_1] [get_bd_pins system_ila_0/probe9] \
  [get_bd_pins generic_iq_observer_0/adc_data_1]
connect_bd_net -net rx_adrv9009_tpl_core_adc_data_2 [get_bd_pins rx_adrv9009_tpl_core/adc_data_2] \
  [get_bd_pins rx_fir_decimator/data_in_2] [get_bd_pins system_ila_0/probe10] [get_bd_pins generic_iq_observer_0/adc_data_2]
connect_bd_net -net rx_adrv9009_tpl_core_adc_data_3 [get_bd_pins rx_adrv9009_tpl_core/adc_data_3] \
  [get_bd_pins rx_fir_decimator/data_in_3] [get_bd_pins system_ila_0/probe11] [get_bd_pins generic_iq_observer_0/adc_data_3]
connect_bd_net -net rx_adrv9009_tpl_core_adc_enable_0 [get_bd_pins rx_adrv9009_tpl_core/adc_enable_0] \
  [get_bd_ports adc_enable_0] [get_bd_pins rx_fir_decimator/enable_in_0] [get_bd_pins iq_enable_concat/In0]
connect_bd_net -net rx_adrv9009_tpl_core_adc_enable_1 [get_bd_pins rx_adrv9009_tpl_core/adc_enable_1] \
  [get_bd_ports adc_enable_1] [get_bd_pins rx_fir_decimator/enable_in_1] [get_bd_pins iq_enable_concat/In1]
connect_bd_net [get_bd_pins rx_adrv9009_tpl_core/adc_enable_2] [get_bd_pins rx_fir_decimator/enable_in_2] [get_bd_pins iq_enable_concat/In2]
connect_bd_net [get_bd_pins rx_adrv9009_tpl_core/adc_enable_3] [get_bd_pins rx_fir_decimator/enable_in_3] [get_bd_pins iq_enable_concat/In3]
connect_bd_net -net rx_adrv9009_tpl_core_adc_valid_0 [get_bd_pins rx_adrv9009_tpl_core/adc_valid_0] \
  [get_bd_ports adc_valid_0] [get_bd_pins rx_fir_decimator/valid_in_0]
connect_bd_net -net rx_adrv9009_tpl_core_adc_valid_1 [get_bd_pins rx_adrv9009_tpl_core/adc_valid_1] \
  [get_bd_ports adc_valid_1] [get_bd_pins rx_fir_decimator/valid_in_1]
connect_bd_net [get_bd_pins rx_adrv9009_tpl_core/adc_valid_2] [get_bd_pins rx_fir_decimator/valid_in_2]
connect_bd_net [get_bd_pins rx_adrv9009_tpl_core/adc_valid_3] [get_bd_pins rx_fir_decimator/valid_in_3]
connect_bd_net [get_bd_ports rx_data_0_n] [get_bd_pins util_adrv9009_xcvr/rx_0_n]
connect_bd_net [get_bd_ports rx_data_0_p] [get_bd_pins util_adrv9009_xcvr/rx_0_p]
connect_bd_net [get_bd_ports rx_data_1_n] [get_bd_pins util_adrv9009_xcvr/rx_1_n]
connect_bd_net [get_bd_ports rx_data_1_p] [get_bd_pins util_adrv9009_xcvr/rx_1_p]
connect_bd_net [get_bd_ports rx_data_2_n] [get_bd_pins util_adrv9009_xcvr/rx_2_n]
connect_bd_net [get_bd_ports rx_data_2_p] [get_bd_pins util_adrv9009_xcvr/rx_2_p]
connect_bd_net [get_bd_ports rx_data_3_n] [get_bd_pins util_adrv9009_xcvr/rx_3_n]
connect_bd_net [get_bd_ports rx_data_3_p] [get_bd_pins util_adrv9009_xcvr/rx_3_p]
connect_bd_net [get_bd_pins rx_fir_decimator/data_out_0] [get_bd_pins util_adrv9009_rx_cpack/fifo_wr_data_0]
connect_bd_net [get_bd_pins rx_fir_decimator/data_out_1] [get_bd_pins util_adrv9009_rx_cpack/fifo_wr_data_1]
connect_bd_net [get_bd_pins rx_fir_decimator/data_out_2] [get_bd_pins util_adrv9009_rx_cpack/fifo_wr_data_2]
connect_bd_net [get_bd_pins rx_fir_decimator/data_out_3] [get_bd_pins util_adrv9009_rx_cpack/fifo_wr_data_3]
connect_bd_net [get_bd_pins rx_fir_decimator/enable_out_0] [get_bd_pins util_adrv9009_rx_cpack/enable_0]
connect_bd_net [get_bd_pins rx_fir_decimator/enable_out_1] [get_bd_pins util_adrv9009_rx_cpack/enable_1]
connect_bd_net [get_bd_pins rx_fir_decimator/enable_out_2] [get_bd_pins util_adrv9009_rx_cpack/enable_2]
connect_bd_net [get_bd_pins rx_fir_decimator/enable_out_3] [get_bd_pins util_adrv9009_rx_cpack/enable_3]
connect_bd_net [get_bd_pins rx_fir_decimator/valid_out_0] [get_bd_pins util_adrv9009_rx_cpack/fifo_wr_en]
connect_bd_net [get_bd_pins rx_os_adrv9009_tpl_core/adc_data_0] [get_bd_pins util_adrv9009_rx_os_cpack/fifo_wr_data_0]
connect_bd_net [get_bd_pins rx_os_adrv9009_tpl_core/adc_data_1] [get_bd_pins util_adrv9009_rx_os_cpack/fifo_wr_data_1]
connect_bd_net [get_bd_pins rx_os_adrv9009_tpl_core/adc_data_2] [get_bd_pins util_adrv9009_rx_os_cpack/fifo_wr_data_2]
connect_bd_net [get_bd_pins rx_os_adrv9009_tpl_core/adc_data_3] [get_bd_pins util_adrv9009_rx_os_cpack/fifo_wr_data_3]
connect_bd_net [get_bd_pins rx_os_adrv9009_tpl_core/adc_enable_0] [get_bd_pins util_adrv9009_rx_os_cpack/enable_0]
connect_bd_net [get_bd_pins rx_os_adrv9009_tpl_core/adc_enable_1] [get_bd_pins util_adrv9009_rx_os_cpack/enable_1]
connect_bd_net [get_bd_pins rx_os_adrv9009_tpl_core/adc_enable_2] [get_bd_pins util_adrv9009_rx_os_cpack/enable_2]
connect_bd_net [get_bd_pins rx_os_adrv9009_tpl_core/adc_enable_3] [get_bd_pins util_adrv9009_rx_os_cpack/enable_3]
